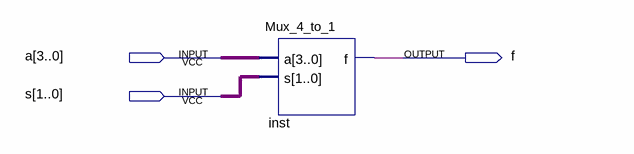
[diagram p0: schematic sheet]
// Quartus schematic Block1.bdf as structural Verilog: 1 symbols, 3 pins
module Block1 (
  input  [3:0] a,
  input  [1:0] s,
  output f
);

  Mux_4_to_1 inst (.a(a), .s(s), .f(f));
endmodule
